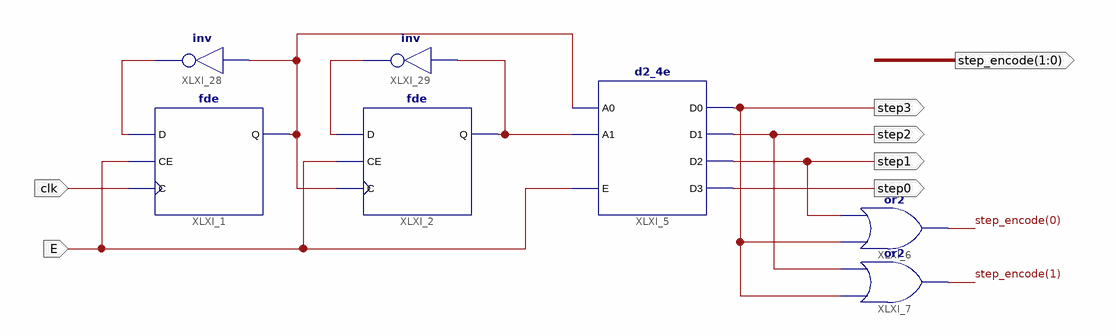
[diagram p0: schematic sheet 1]
// Xilinx ISE schematic timing_generator.sch (spartan6) as structural Verilog: 7 symbols, 7 ports
module timing_generator (
  input  E,
  input  clk,
  output step3,
  output step2,
  output step1,
  output step0,
  output [1:0] step_encode
);

  wire XLXN_14, XLXN_16, XLXN_17, XLXN_18;

  fde XLXI_1 (.C(clk), .CE(E), .D(XLXN_17), .Q(XLXN_14));
  fde XLXI_2 (.C(XLXN_14), .CE(E), .D(XLXN_18), .Q(XLXN_16));
  d2_4e XLXI_5 (.A0(XLXN_14), .A1(XLXN_16), .E(E), .D0(step3), .D1(step2), .D2(step1), .D3(step0));
  or XLXI_6 (step_encode[0], step3, step1);
  not XLXI_28 (XLXN_17, XLXN_14);
  not XLXI_29 (XLXN_18, XLXN_16);
  or XLXI_7 (step_encode[1], step3, step2);
endmodule
